# Altium project Smart_Metter.PrjPcb
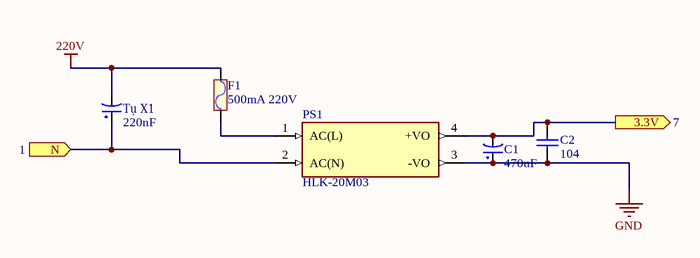
[diagram p0: Nguon.SchDoc]
5 sheets, 19 parts. Net scope: flat (ports and power ports of the same name join across sheets).
Sheets:
  Nguon.SchDoc
  ESP32.SchDoc
  MicroSD.SchDoc
  RS485.SchDoc
  KhoiPhu.SchDoc

## Sheet Nguon.SchDoc
size A; SheetNumber: 2; SheetTotal: 6

### Parts
C1  470uF  [tu hoa 16mm]
C2  104  [tu gom]
F1  500mA 220V  [Cau chi tu phuc hoi 2A 24V SMD1812]
PS1  HLK-20M03  [CONV_HLK-20M05]
Tụ_X1  220nF  [tu hoa 8mm]

### Ports
3.3V (out, see 7), N (in, see 1)

### Nets
220V: F1.2 Tụ_X1.2
GND: C1.1 C2.2 PS1.3(-VO)
NetC1_2: C1.2 C2.1 PS1.4(+VO) ; port 3.3V
NetF1_1: F1.1 PS1.1(AC(L))
NetPS1_2: PS1.2(AC(N)) Tụ_X1.1 ; port N

### Library data of the parts
C1 = Tu Hoa 470uF 100V 16x25: Cắm; Don_Vi: Con; So_Chan: 2; Ten_Linh_Kien: Tụ Hóa 470uF 100V 16x25MM; Ma_Hang: MH008785; Chung_Loai: Cắm; Kieu_Chan: *
C2 = Tu gom 104 50V: Cắm; So_Chan: 2; Ten_Linh_Kien: Tụ gốm 104 100nF 50V; Don_Vi: Con; Ma_Hang: MH004761; Chung_Loai: Cắm; Kieu_Chan: *
F1 = Cau chi tu phuc hoi 2A 24V SMD1812: 2A 24V SMD1812; Ma_Hang: MH010033; Ten: Cầu Chì Tự Phục Hồi 2A 24V SMD1812
PS1 = HLK-20M05: 20W ultra-small series module power supply; MF: Hi-link; Value: *; Package: Non-Standard Hi-link; MP: HLK-20M05; Check_prices: https://www.snapeda.com/parts/HLK-20M05/Hi-link/view-part/?ref=eda; SnapEDA_Link: https://www.snapeda.com/parts/HLK-20M05/Hi-link/view-part/?ref=snap; Price: None; Availability: Not in stock
Tụ_X1 = Tu Hoa 220uF 35V 8x12: Cắm; Don_Vi: Con; So_Chan: 2; Ten_Linh_Kien: Tụ Hóa 220uF 35V 8x12MM; Ma_Hang: MH006553; Chung_Loai: Cắm; Kieu_Chan: *

## Sheet ESP32.SchDoc
size A; SheetNumber: 3; SheetTotal: 6
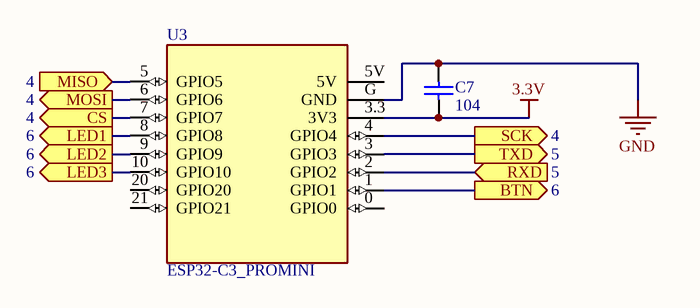
[diagram p1: ESP32.SchDoc]

### Parts
C7  104  [tu gom]
U3  ESP32-C3_PROMINI  [MODULE_ESP32-C3_SUPERMINI_TH]

### Ports
BTN (out, see 6), CS (out, see 4), LED1 (out, see 6), LED2 (out, see 6), LED3 (out, see 6), MISO (in, see 4), MOSI (out, see 4), RXD (in, see 5), SCK (out, see 4), TXD (out, see 5)

### Nets
3.3V: C7.1 U3.3.3(3V3)
GND: C7.2 U3.G(GND)
NetC10_2: U3.1(GPIO1) ; port BTN
NetR1_1: U3.8(GPIO8) ; port LED1
NetR2_1: U3.9(GPIO9) ; port LED2
NetR3_1: U3.10(GPIO10) ; port LED3
NetU2_5: U3.2(GPIO2) ; port RXD
NetU2_7: U3.3(GPIO3) ; port TXD
NetU3_4: U3.4(GPIO4) ; port SCK
NetU3_5: U3.5(GPIO5) ; port MISO
NetU3_6: U3.6(GPIO6) ; port MOSI
NetU3_7: U3.7(GPIO7) ; port CS

Not connected (* = marked no-connect by the designer): U3 0(GPIO0) 5V 20(GPIO20) 21(GPIO21)

### Library data of the parts
C7 = Tu gom 104 50V: as C2 on sheet Nguon; Chung_Loai: Cắm; Kieu_Chan: *
U3 = ESP32-C3_SUPERMINI_TH: Super tiny ESP32-C3 board; MF: Espressif Systems; MP: ESP32-C3 SuperMini_TH; SnapEDA_Link: https://www.snapeda.com/parts/ESP32-C3%20SuperMini_TH/Espressif+Systems/view-part/?ref=snap; Package: Package; Value: *; Check_prices: https://www.snapeda.com/parts/ESP32-C3%20SuperMini_TH/Espressif+Systems/view-part/?ref=eda

## Sheet MicroSD.SchDoc
size A; SheetNumber: 4; SheetTotal: 6
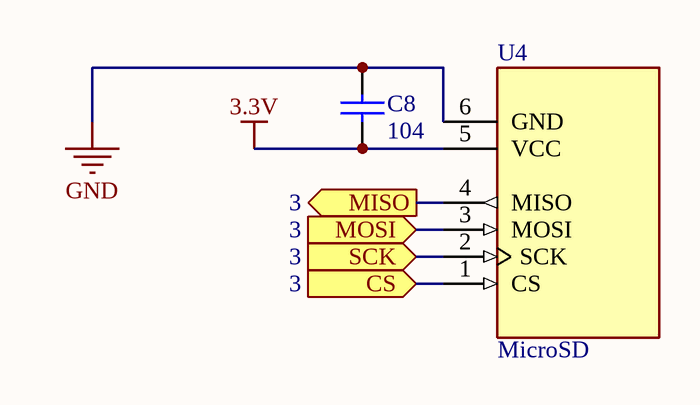
[diagram p2: MicroSD.SchDoc]

### Parts
C8  104  [tu gom]
U4  MicroSD  [MODULE_254]

### Ports
CS (in, see 3), MISO (out, see 3), MOSI (in, see 3), SCK (in, see 3)

### Nets
3.3V: C8.2 U4.5(VCC)
GND: C8.1 U4.6(GND)
NetU3_4: U4.2(SCK) ; port SCK
NetU3_5: U4.4(MISO) ; port MISO
NetU3_6: U4.3(MOSI) ; port MOSI
NetU3_7: U4.1(CS) ; port CS

### Library data of the parts
C8 = Tu gom 104 50V: as C2 on sheet Nguon; Chung_Loai: Cắm; Kieu_Chan: *
U4 = 254: MicroSD card breakout board+; MF: Keystone Electronics; Check_prices: https://www.snapeda.com/parts/254/Adafruit+Industries/view-part/?ref=eda; Value: *; Purchase-URL: https://pricing.snapeda.com/search/part/254/?ref=eda; Package: Keystone Electronics; Price: None; MP: 254; Availability: In Stock; SnapEDA_Link: https://www.snapeda.com/parts/254/Adafruit+Industries/view-part/?ref=snap

## Sheet RS485.SchDoc
size A; SheetNumber: 5; SheetTotal: 6
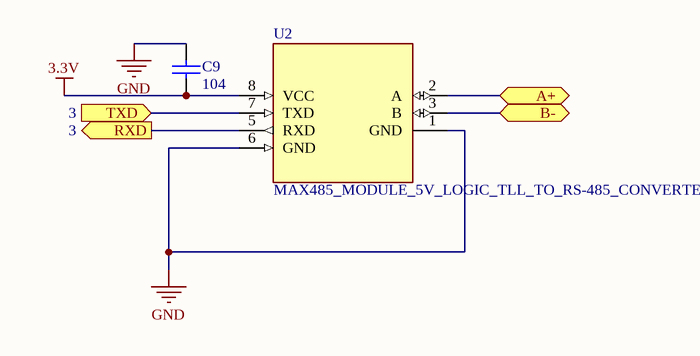
[diagram p3: RS485.SchDoc]

### Parts
C9  104  [tu gom]
U2  MAX485_MODULE_5V_LOGIC_TLL_TO_RS-485_CONVERTER  [MODULE_MAX485_MODULE_5V_LOGIC_TLL_TO_RS-485_CONVERTER]

### Ports
A+ (bidir), B- (bidir), RXD (out, see 3), TXD (in, see 3)

### Nets
3.3V: C9.2 U2.8(VCC)
GND: C9.1 U2.1(GND) U2.6(GND)
NetU2_2: U2.2(A) ; port A+
NetU2_3: U2.3(B) ; port B-
NetU2_5: U2.5(RXD) ; port RXD
NetU2_7: U2.7(TXD) ; port TXD

### Library data of the parts
C9 = Tu gom 104 50V: as C2 on sheet Nguon; Chung_Loai: Cắm; Kieu_Chan: *
U2 = MAX485_MODULE_5V_LOGIC_TLL_TO_RS-485_CONVERTER: 5V MAX485 TTL To RS485 Converter Module Board for Arduino; MP: MAX485 Module 5V logic TLL to RS-485 converter; MF: e-Gizmo Mechatronix Central; Value: *; SnapEDA_Link: https://www.snapeda.com/parts/MAX485%20Module%205V%20logic%20TLL%20to%20RS-485%20converter/e-Gizmo+Mechatronix+Central/view-part/?ref=snap; Package: Package; Availability: Not in stock; Check_prices: https://www.snapeda.com/parts/MAX485%20Module%205V%20logic%20TLL%20to%20RS-485%20converter/e-Gizmo+Mechatronix+Central/view-part/?ref=eda; Price: None

## Sheet KhoiPhu.SchDoc
size A; SheetNumber: 6; SheetTotal: 6
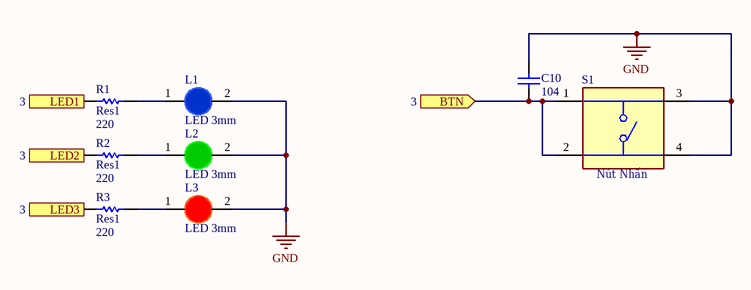
[diagram p4: KhoiPhu.SchDoc]

### Parts
C10  104  [tu gom]
L1  LED 3mm  [LED-3MM-BLUE]
L2  LED 3mm  [LED-3MM-GREEN]
L3  LED 3mm  [LED-3MM-RED]
R1  Res1  value 220  [AXIAL-0.3]
R2  Res1  value 220  [AXIAL-0.3]
R3  Res1  value 220  [AXIAL-0.3]
S1  Nút Nhấn  [SW_TS04-66-95-BK-100-SMT]

### Ports
BTN (in, see 3), LED1 (in, see 3), LED2 (in, see 3), LED3 (in, see 3)

### Nets
GND: C10.1 L1.2(K) L2.2(K) L3.2(K) S1.3 S1.4
NetC10_2: C10.2 S1.1 S1.2 ; port BTN
NetL1_1: L1.1(A) R1.2
NetL2_1: L2.1(A) R2.2
NetL3_1: L3.1(A) R3.2
NetR1_1: R1.1 ; port LED1
NetR2_1: R2.1 ; port LED2
NetR3_1: R3.1 ; port LED3

### Library data of the parts
C10 = Tu gom 104 50V: as C2 on sheet Nguon; Chung_Loai: Cắm; Kieu_Chan: *
L1 = LED 3mm Xanh Duong: Cắm; Don_Vi: Con; Ma_Hang: MH009003; Ten_Linh_Kien: LED 3MM Xanh Dương SS (1000c); Ghi_Chu: *; Kieu_Chan: *; Chung_Loai: Cắm
L2 = LED 3mm Xanh La: Cắm; Don_Vi: Con; Ma_Hang: MH001054; Ten_Linh_Kien: Led 3MM Phủ Xanh (10c); Ghi_Chu: *; Kieu_Chan: *; Chung_Loai: Cắm
L3 = LED 3mm Do: Cắm; Don_Vi: Con; Ma_Hang: MH003892; Ten_Linh_Kien: Led 3MM Phủ Đỏ (10c); Ghi_Chu: *; Kieu_Chan: *; Chung_Loai: Cắm
R1-R3 = Res1: Resistor; Published: 8-Jun-2000; LatestRevisionDate: 17-Jul-2002; LatestRevisionNote: Re-released for DXP Platform.; PackageReference: AXIAL-0.3; Publisher: Altium Limited; PackageDescription: Axial Device, Thru-Hole; 2 Leads; 0.3 in Pin Spacing
S1 = TS04-66-95-BK-100-SMT: 6 x 6 mm, 9.5 mm Actuator Height, 100 gf, Black, Surface Mount, SPST, Tactile Switch; MF: Same Sky; SnapEDA_Link: https://www.snapeda.com/parts/TS04-66-95-BK-100-SMT/Same+Sky/view-part/?ref=snap; Package: None; Value: *; MP: TS04-66-95-BK-100-SMT; Check_prices: https://www.snapeda.com/parts/TS04-66-95-BK-100-SMT/Same+Sky/view-part/?ref=eda

## Nets that join several sheets
3.3V: ESP32 (C7.1 U3.3.3), MicroSD (C8.2 U4.5), RS485 (C9.2 U2.8)
GND: Nguon (C1.1 C2.2 PS1.3), ESP32 (C7.2 U3.G), MicroSD (C8.1 U4.6), RS485 (C9.1 U2.1 U2.6), KhoiPhu (6 pins)
NetC10_2: ESP32 (U3.1), KhoiPhu (C10.2 S1.1 S1.2)
NetR1_1: ESP32 (U3.8), KhoiPhu (R1.1)
NetR2_1: ESP32 (U3.9), KhoiPhu (R2.1)
NetR3_1: ESP32 (U3.10), KhoiPhu (R3.1)
NetU2_5: ESP32 (U3.2), RS485 (U2.5)
NetU2_7: ESP32 (U3.3), RS485 (U2.7)
NetU3_4: ESP32 (U3.4), MicroSD (U4.2)
NetU3_5: ESP32 (U3.5), MicroSD (U4.4)
NetU3_6: ESP32 (U3.6), MicroSD (U4.3)
NetU3_7: ESP32 (U3.7), MicroSD (U4.1)